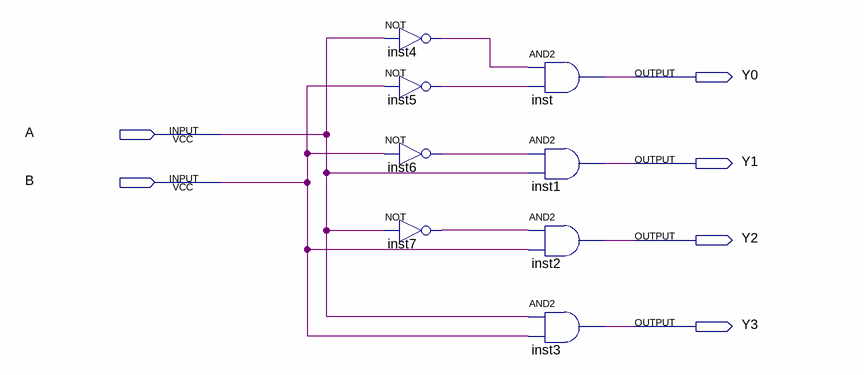
[diagram p0: schematic sheet]
// Quartus schematic 2bit_decoder.bdf as structural Verilog: 8 symbols, 6 pins
module \2bit_decoder  (
  input  A,
  input  B,
  output Y0,
  output Y1,
  output Y2,
  output Y3
);

  wire inst4_out, inst5_out, inst6_out, inst7_out;

  not inst4 (inst4_out, A);
  not inst5 (inst5_out, B);
  not inst6 (inst6_out, B);
  not inst7 (inst7_out, A);
  and inst (Y0, inst4_out, inst5_out);
  and inst1 (Y1, inst6_out, A);
  and inst2 (Y2, inst7_out, B);
  and inst3 (Y3, A, B);
endmodule
